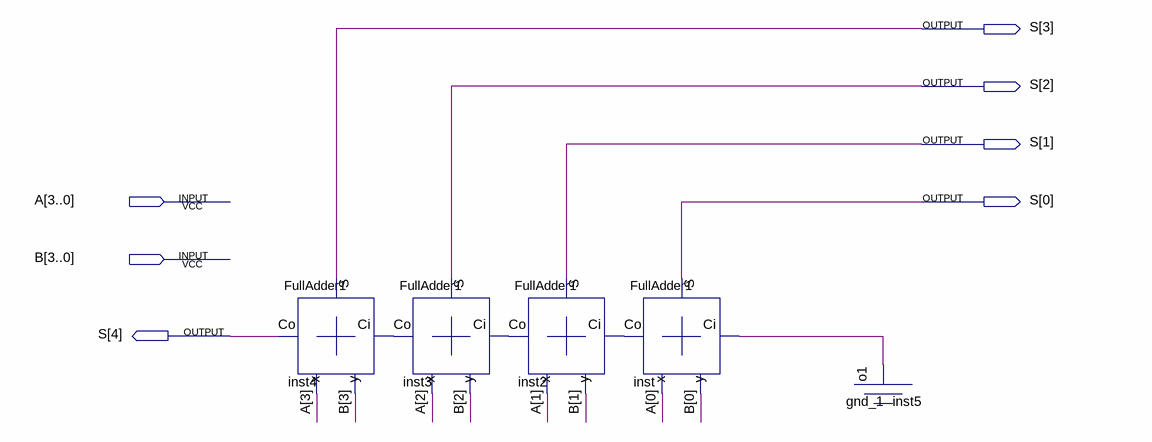
[diagram p0: schematic sheet]
// Quartus schematic FA4.bdf as structural Verilog: 5 symbols, 7 pins
module FA4 (
  input  [3:0] A,
  input  [3:0] B,
  output [4:0] S
);

  wire inst2_co, inst3_co, inst5_o1, inst_co;

  FullAdder1 inst4 (.y(B[3]), .Ci(inst3_co), .x(A[3]), .S(S[3]), .Co(S[4]));
  FullAdder1 inst3 (.y(B[2]), .Ci(inst2_co), .x(A[2]), .S(S[2]), .Co(inst3_co));
  FullAdder1 inst2 (.y(B[1]), .Ci(inst_co), .x(A[1]), .S(S[1]), .Co(inst2_co));
  FullAdder1 inst (.y(B[0]), .Ci(inst5_o1), .x(A[0]), .S(S[0]), .Co(inst_co));
  gnd_1 inst5 (.o1(inst5_o1));
endmodule
